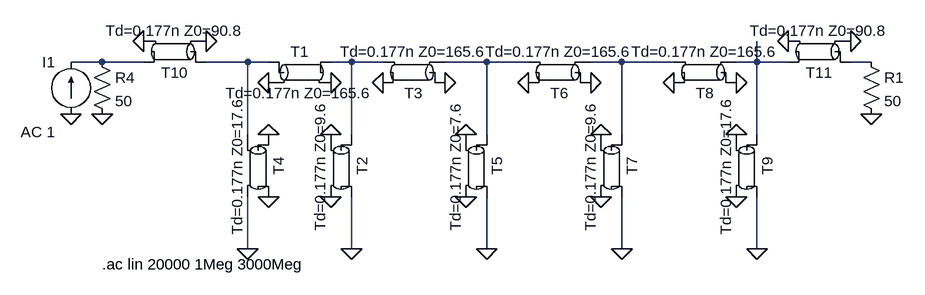
[diagram p0: schematic micro_filter.asc]
micro_filter.asc, the LTspice schematic file:
Version 4
SHEET 1 1064 680
WIRE -176 48 -224 48
WIRE -112 48 -176 48
WIRE 48 48 -16 48
WIRE 80 48 48 48
WIRE 208 48 176 48
WIRE 256 48 208 48
WIRE 416 48 352 48
WIRE 480 48 416 48
WIRE 624 48 576 48
WIRE 704 48 624 48
WIRE 832 48 832 16
WIRE 832 48 800 48
WIRE 880 48 832 48
WIRE 1008 48 976 48
WIRE 48 160 48 48
WIRE 208 160 208 48
WIRE 416 160 416 48
WIRE 624 160 624 48
WIRE 832 160 832 48
WIRE 48 336 48 256
WIRE 208 336 208 256
WIRE 416 336 416 256
WIRE 624 336 624 256
WIRE 832 336 832 256
FLAG 80 256 0
FLAG 176 256 0
FLAG 176 160 0
FLAG 80 160 0
FLAG 48 336 0
FLAG 208 336 0
FLAG -224 128 0
FLAG -176 128 0
FLAG 384 256 0
FLAG 384 160 0
FLAG 416 336 0
FLAG 592 256 0
FLAG 592 160 0
FLAG 624 336 0
FLAG 1008 128 0
FLAG 800 256 0
FLAG 800 160 0
FLAG 832 336 0
FLAG -16 16 0
FLAG -112 16 0
FLAG 880 16 0
FLAG 976 16 0
FLAG 80 80 0
FLAG 176 80 0
FLAG 256 80 0
FLAG 352 80 0
FLAG 480 80 0
FLAG 576 80 0
FLAG 704 80 0
FLAG 800 80 0
SYMBOL tline 128 64 R0
SYMATTR InstName T1
SYMATTR Value Td=0.177n Z0=165.6
SYMBOL tline 192 208 R90
SYMATTR InstName T2
SYMATTR Value Td=0.177n Z0=9.6
SYMBOL tline 64 208 R90
SYMATTR InstName T4
SYMATTR Value Td=0.177n Z0=17.6
SYMBOL current -224 128 R180
WINDOW 0 24 80 Left 2
WINDOW 3 24 0 Left 2
WINDOW 123 24 -28 Left 2
WINDOW 39 0 0 Left 0
SYMATTR InstName I1
SYMATTR Value ""
SYMATTR Value2 AC 1
SYMBOL res -192 32 R0
SYMATTR InstName R4
SYMATTR Value 50
SYMBOL tline 304 64 R180
SYMATTR InstName T3
SYMATTR Value Td=0.177n Z0=165.6
SYMBOL tline 400 208 R90
SYMATTR InstName T5
SYMATTR Value Td=0.177n Z0=7.6
SYMBOL tline 608 208 R90
SYMATTR InstName T7
SYMATTR Value Td=0.177n Z0=9.6
SYMBOL res 992 32 R0
SYMATTR InstName R1
SYMATTR Value 50
SYMBOL tline 816 208 R90
SYMATTR InstName T9
SYMATTR Value Td=0.177n Z0=17.6
SYMBOL tline -64 32 R180
SYMATTR InstName T10
SYMATTR Value Td=0.177n Z0=90.8
SYMBOL tline 928 32 R180
SYMATTR InstName T11
SYMATTR Value Td=0.177n Z0=90.8
SYMBOL tline 528 64 R180
SYMATTR InstName T6
SYMATTR Value Td=0.177n Z0=165.6
SYMBOL tline 752 64 R180
SYMATTR InstName T8
SYMATTR Value Td=0.177n Z0=165.6
TEXT -176 360 Left 2 !.ac lin 20000 1Meg 3000Meg

The netlist it stands for:
* micro_filter.asc
T1 N002 0 N003 0 Td=0.177n Z0=165.6
T2 N003 0 0 0 Td=0.177n Z0=9.6
T4 0 N002 0 0 Td=0.177n Z0=17.6
I1 0 N001 AC 1
R4 N001 0 50
T3 0 N004 0 N003 Td=0.177n Z0=165.6
T5 N004 0 0 0 Td=0.177n Z0=7.6
T7 N005 0 0 0 Td=0.177n Z0=9.6
R1 N007 0 50
T9 N006 0 0 0 Td=0.177n Z0=17.6
T10 N002 0 N001 0 Td=0.177n Z0=90.8
T11 N007 0 N006 0 Td=0.177n Z0=90.8
T6 0 N005 0 N004 Td=0.177n Z0=165.6
T8 0 N006 0 N005 Td=0.177n Z0=165.6
.ac lin 20000 1Meg 3000Meg
.backanno
.end